# EAGLE design LCDShield (EAGLE 5.11)
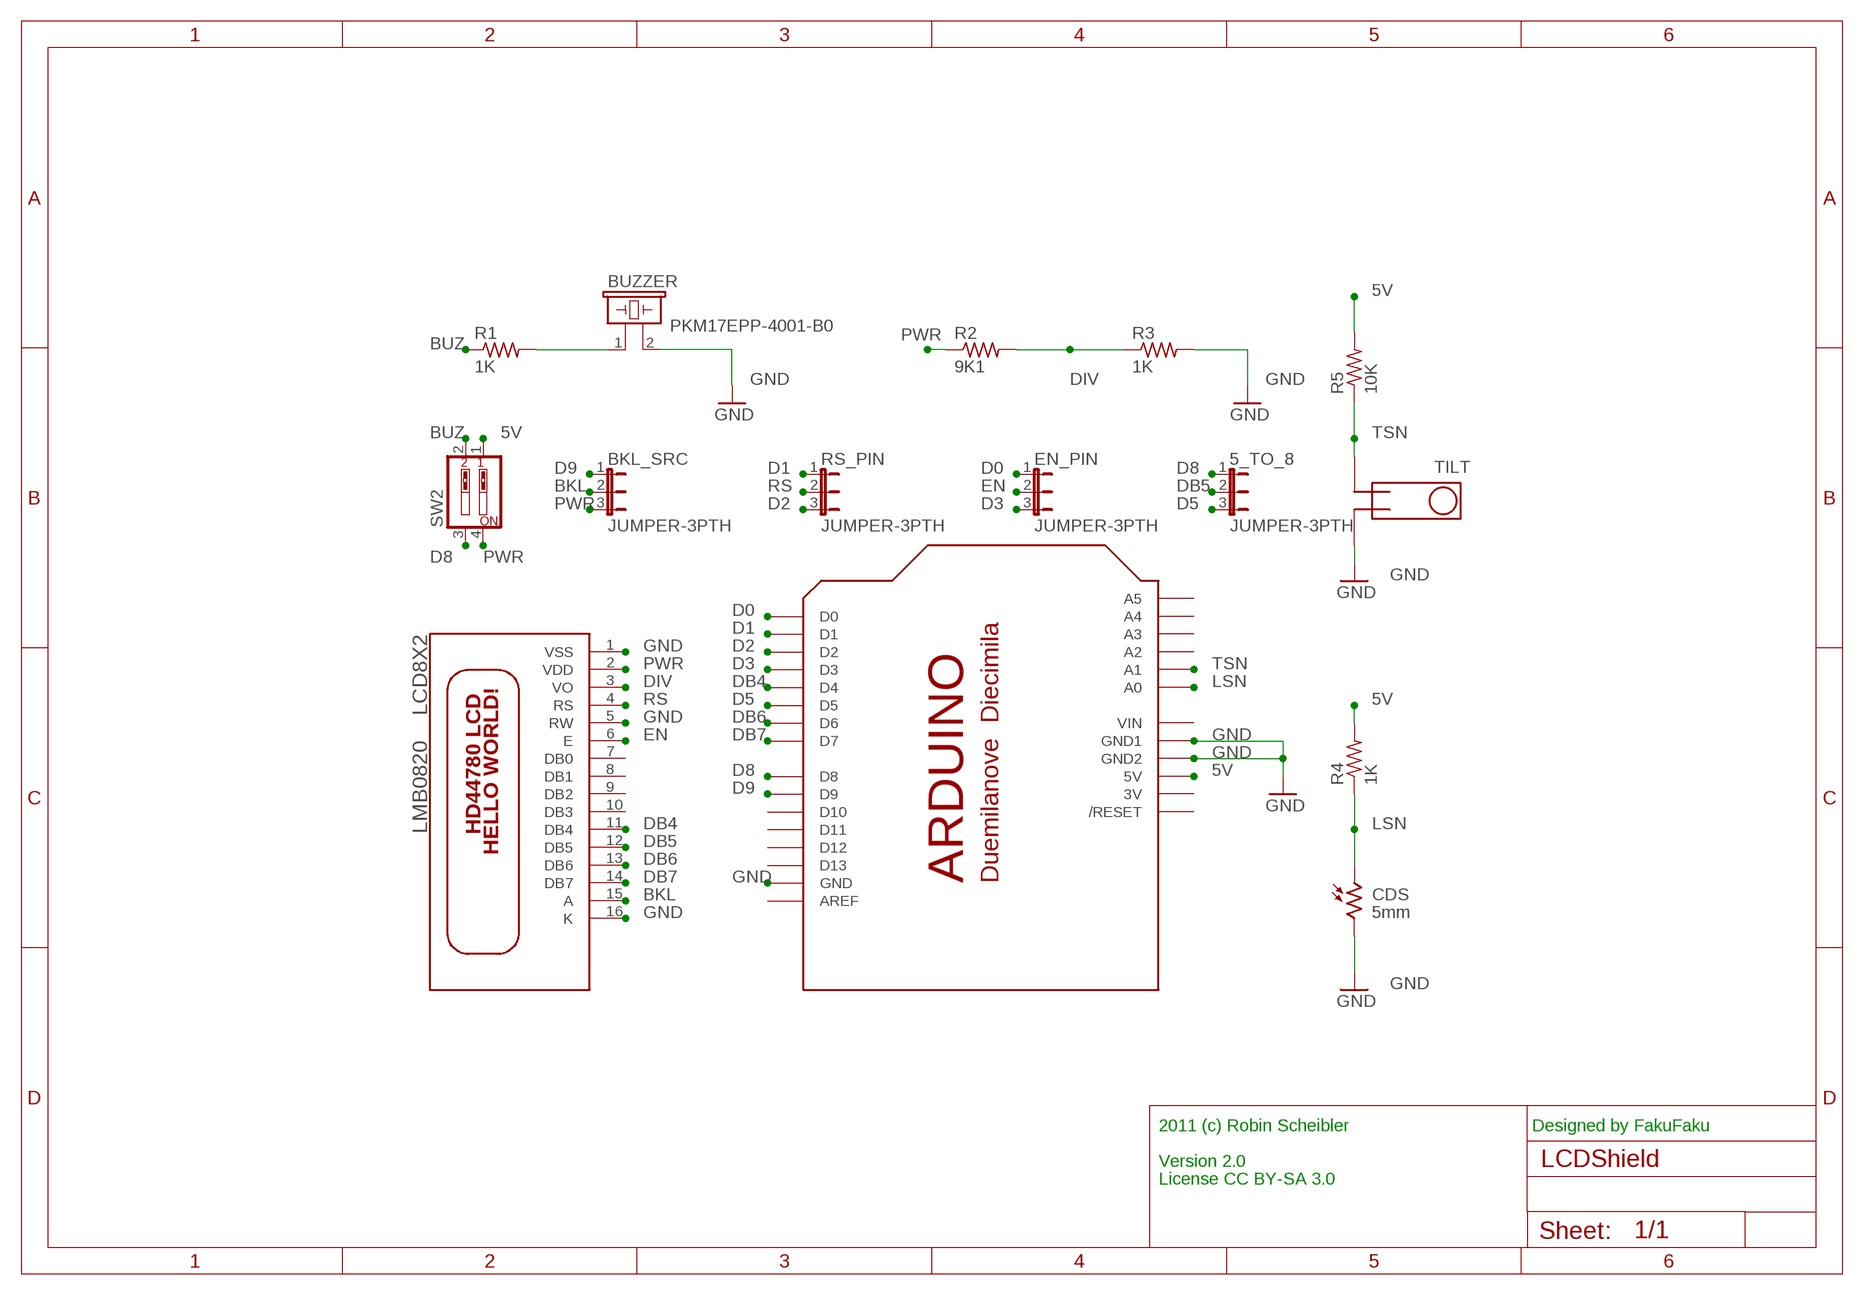
[diagram p0: schematic, sheet 1]

## Parts
5_TO_8  JUMPER-3PTH  [1X03]
BKL_SRC  JUMPER-3PTH  [1X03]
BUZZER  PKM17EPP-4001-B0  [PKM17EPP-4001-B0]
CDS  5mm  VT20N1  [TO46-VT200]
EN_PIN  JUMPER-3PTH  [1X03]
LCD8X2  LMB0820  [LMB0820]
R1  1K  R-US_0207/10  [0207/10]
R2  9K1  R-US_0207/10  [0207/10]
R3  1K  R-US_0207/10  [0207/10]
R4  1K  R-US_0207/10  [0207/10]
R5  10K  R-US_0207/10  [0207/10]
RS_PIN  JUMPER-3PTH  [1X03]
SHIELD  ARDUINOSHIELD-NOHOLE  [ARDUINO-NOHOLE]
SW2  SW_DIP-2  [EDG-02]
TILT  RBS040200  TILT_SWITCH  [RBS040200]

## Nets
5V: R4.2 R5.2 SHIELD.5V SW2.1
BKL: BKL_SRC.2 LCD8X2.15(A)
BUZ: R1.1 SW2.2
D0: EN_PIN.1 SHIELD.D0
D1: RS_PIN.1 SHIELD.D1
D2: RS_PIN.3 SHIELD.D2
D3: EN_PIN.3 SHIELD.D3
D5: 5_TO_8.3 SHIELD.D5
D8: 5_TO_8.1 SHIELD.D8 SW2.3
D9: BKL_SRC.1 SHIELD.D9
DB4: LCD8X2.11(DB4) SHIELD.D4
DB5: 5_TO_8.2 LCD8X2.12(DB5)
DB6: LCD8X2.13(DB6) SHIELD.D6
DB7: LCD8X2.14(DB7) SHIELD.D7
DIV: LCD8X2.3(VO) R2.2 R3.1
EN: EN_PIN.2 LCD8X2.6(E)
GND: BUZZER.2 CDS.2 LCD8X2.1(VSS) LCD8X2.5(RW) LCD8X2.16(K) R3.2 SHIELD.GND SHIELD.GND1 SHIELD.GND2 TILT.3
LSN: CDS.1 R4.1 SHIELD.A0
N$1: BUZZER.1 R1.2
PWR: BKL_SRC.3 LCD8X2.2(VDD) R2.1 SW2.4
RS: LCD8X2.4(RS) RS_PIN.2
TSN: R5.1 SHIELD.A1 TILT.4
Unconnected: LCD8X2.7(DB0) LCD8X2.8(DB1) LCD8X2.9(DB2) LCD8X2.10(DB3) SHIELD.A2 SHIELD.A3 SHIELD.A4 SHIELD.A5 SHIELD.AREF SHIELD.D10 SHIELD.D11 SHIELD.D12 SHIELD.D13 SHIELD.RESET(/RESET)

## Notes on the sheet
- 2011 (c) Robin Scheibler | Designed by FakuFaku
- Version 2.0
- License CC BY-SA 3.0

## Power pins joined to a net without a drawn wire
3V: SHIELD.3V
VIN: SHIELD.VIN

## Library data of the parts
5_TO_8 BKL_SRC EN_PIN RS_PIN = SparkFun:JUMPER-3
BUZZER = Robin:PKM17EPP-4001-B0: BUZZER Source: muRata; OC_FARNELL: unknown; OC_NEWARK: unknown
CDS = photo-elements:VT2*: Photoconductive Cell VT200 Series Source: http://optoelectronics.perkinelmer.com/content/Datasheets/DTS_vt200seriesdatasheet.pdf
LCD8X2 = Robin:LMB0820: LMB0820 : LCD Screen from Seeed Studio
R1-R5 = adafruit:R-US_: RESISTOR, American symbol
SHIELD = Robin:ARDUINOSHIELD: Arduino Diecimila/Duemilanove Make a shield with ease, this package has all the named pins as well as the two mounting drill holes and an outline of the USB and DC power connector. The outline is on the DIMENSION layer, so if your board house uses it they will cut the outline to match. http://www.ladyada.net/library/pcb/eaglelibrary.html
SW2 = special:SW_DIP-2: DIP SWITCH
TILT = Robin:TILT_SWITCH: PIN HEADER With larger annulars

## Board
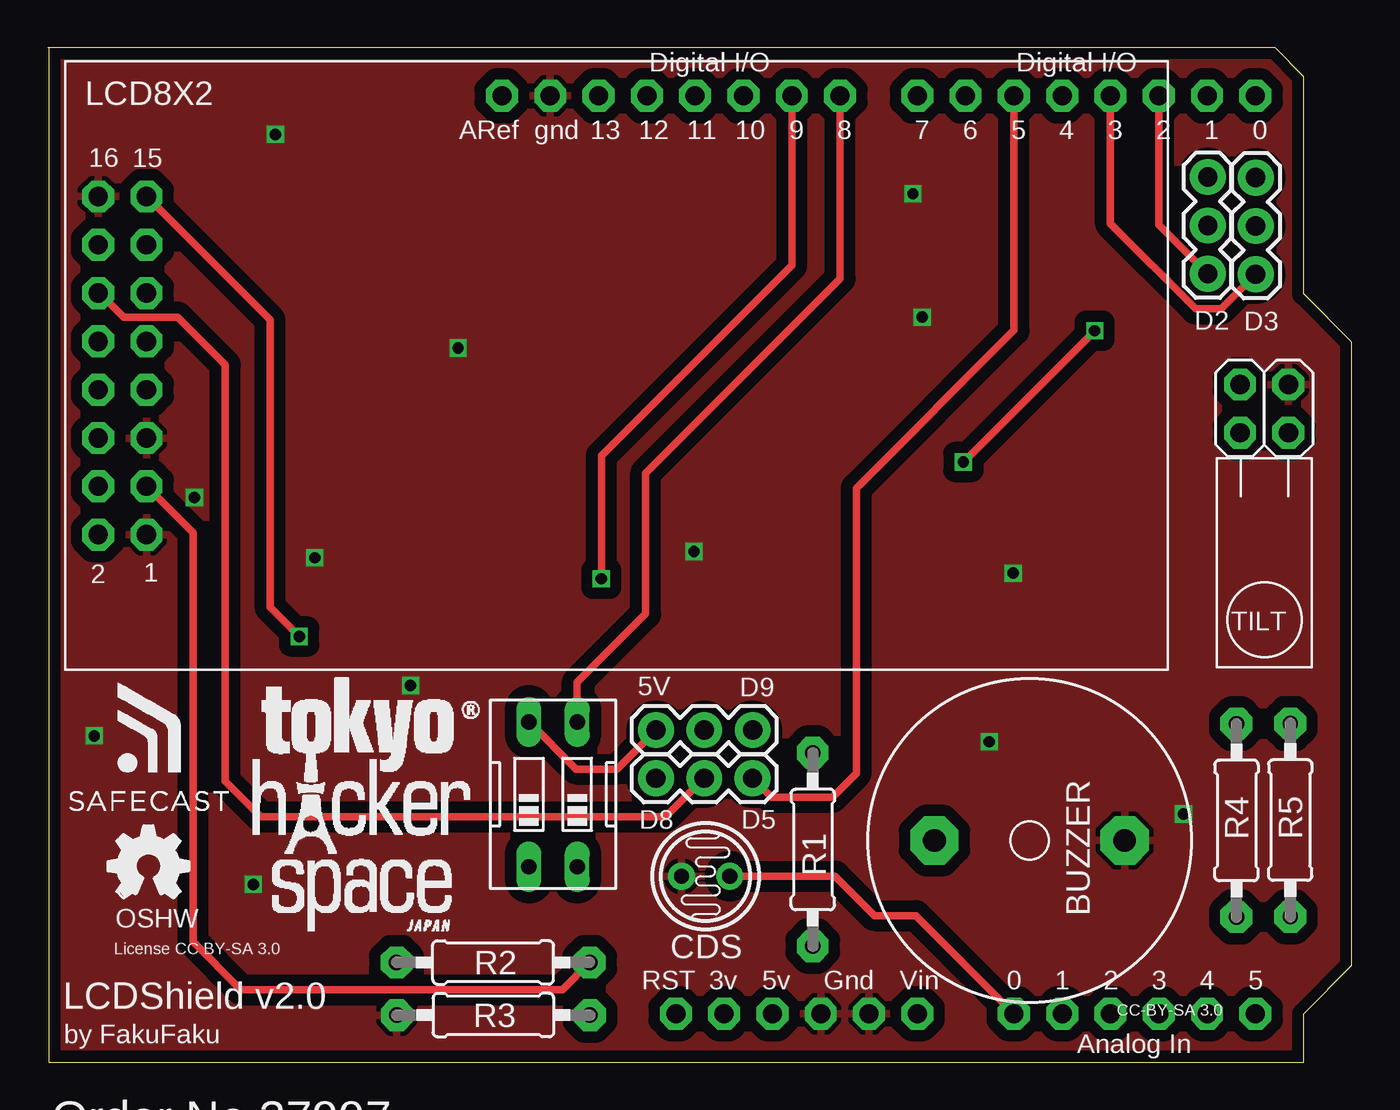
[diagram p1: board, top side]
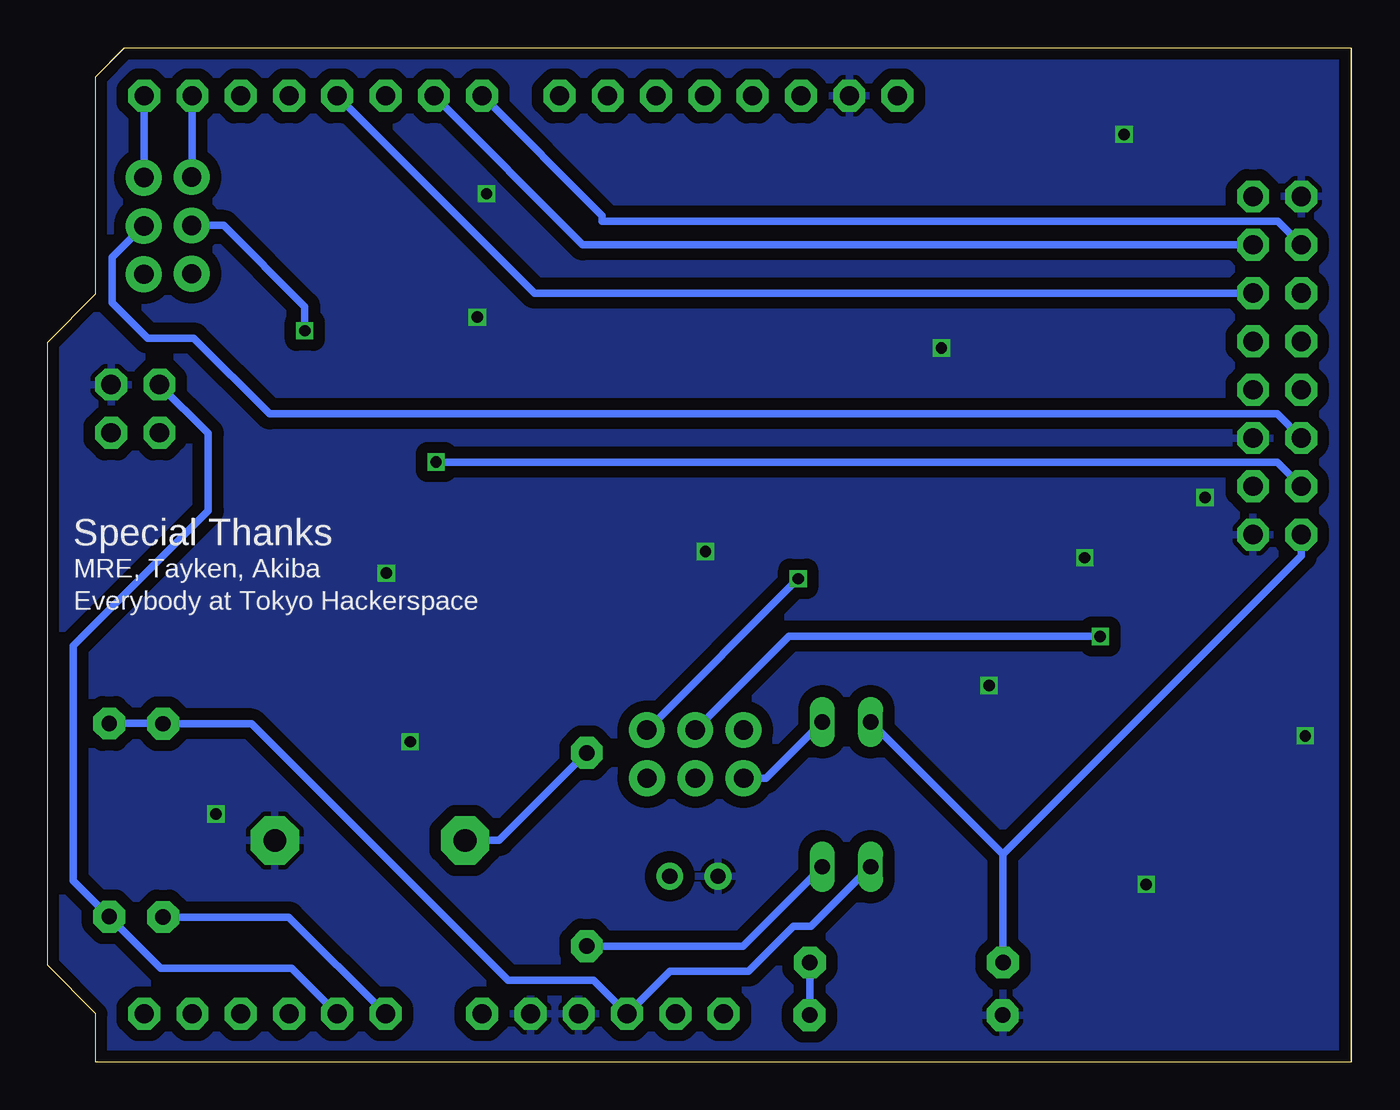
[diagram p2: board, bottom side, seen from below]

Size 68.61 x 53.34 mm. Coordinates in mm from the lower left corner, seen from the top.
Outline: 0,53.33 64.57,53.34 66.07,51.81 66.07,40.39 68.6,37.85 68.61,5.08 66.07,2.54 66.07,0 0.05,0 0.05,53.34
Copper layers (1*16): Top 0.035mm / dielectric 1.5mm / Bottom 0.035mm
Design rules "Fusion_eagle_rule_v1.1": minimum track width 6mil, minimum drill 12mil, track to track 6mil, track to pad 6mil, pad to pad 6mil, via to via 6mil, smd to smd 0mil, copper to edge 10mil, drill to drill 10mil, minimum pad ring 10mil, minimum via ring 6mil, stop-mask expansion 2mil, vias tented up to drill 100mil, thermal gap 10mil

### Footprints (pad centres in the part's own frame; a part is rotated, then mirrored left to right if it is on the bottom)
1X03 = drill 1.016 pad 1.88 round: 1 0,0; 2 2.54,0; 3 5.08,0
PKM17EPP-4001-B0@1 = drill 1.194 pad 2.54 octagon: 1 -5.004,0; 2 5.004,0
TO46-VT200 = drill 0.8 pad 1.4 round: 1 -1.27,0; 2 1.27,0
LMB0820 = drill 1.016 pad 1.676 octagon: 1 -24.73,-8.89; 2 -27.27,-8.89; 3 -24.73,-6.35; 4 -27.27,-6.35; 5 -24.73,-3.81; 6 -27.27,-3.81; 7 -24.73,-1.27; 8 -27.27,-1.27; 9 -24.73,1.27; 10 -27.27,1.27; 11 -24.73,3.81; 12 -27.27,3.81; 13 -24.73,6.35; 14 -27.27,6.35; 15 -24.73,8.89; 16 -27.27,8.89
0207/10 = drill 0.813 pad 1.676 octagon: 1 -5.08,0; 2 5.08,0
ARDUINO-NOHOLE = drill 1 pad 1.676 octagon: 3V 35.56,2.54; 5V 38.1,2.54; A0 50.8,2.54; A1 53.34,2.54; A2 55.88,2.54; A3 58.42,2.54; A4 60.96,2.54; A5 63.5,2.54; AREF 23.876,50.8; D0 63.5,50.8; D1 60.96,50.8; D2 58.42,50.8; D3 55.88,50.8; D4 53.34,50.8; D5 50.8,50.8; D6 48.26,50.8; D7 45.72,50.8; D8 41.656,50.8; D9 39.116,50.8; D10 36.576,50.8; D11 34.036,50.8; D12 31.496,50.8; D13 28.956,50.8; GND 26.416,50.8; GND1 43.18,2.54; GND2 40.64,2.54; RESET 33.02,2.54; VIN 45.72,2.54
EDG-02 = drill 0.813 long: 1 -1.27,-3.81; 2 1.27,-3.81; 3 1.27,3.81; 4 -1.27,3.81
RBS040200 = drill 1.016 pad 1.676 octagon: 1 -1.26,-1.33; 2 1.28,-1.33; 3 -1.26,-3.87; 4 1.28,-3.87

### Placement (x,y rotation side)
5_TO_8  32,14.92 0 top
BKL_SRC  37.09,17.45 180 top
BUZZER  PKM17EPP-4001-B0  [PKM17EPP-4001-B0@1]  51.65,11.65 0 top
CDS  34.61,9.77 180 top
EN_PIN  63.54,46.5 270 top
LCD8X2  29.93,36.62 0 top
R1  40.25,11.18 90 top
R2  23.43,5.24 0 top
R3  23.45,2.47 180 top
R4  62.53,12.71 90 top
R5  65.36,12.72 90 top
RS_PIN  61.02,46.53 270 top
SHIELD  0.03,0 0 top
SW2  26.59,14.08 0 top
TILT  64,31.75 180 top
U$1  [THS]  6.88,3.94 0 top
U$4  [OSHW_FILLX150_NOTEXT]  3.18,8.62 0 top

### Tracks (layer width: path | path; a pad name or v marks a point on that pad's centre or on a via)
5V
  Bottom 0.406: SW2.1 28.45,7.14 29.38,7.14 31.73,4.78 35.87,4.78 38.11,2.54 SHIELD.5V 39.88,4.3 44.38,4.3 57.87,17.79 R4.2 62.55,17.8 R5.2
BKL  (via drill 0.6)
  Top 0.406: v13.24,22.38 11.7,23.92 11.7,39.02 LCD8X2.15
  Bottom 0.406: BKL_SRC.2 29.62,22.38 v13.24,22.38
BUZ
  Bottom 0.406: R1.1 32.03,6.1 SW2.2
D0
  Bottom 0.406: EN_PIN.1 63.53,46.52 SHIELD.D0
D1
  Bottom 0.406: RS_PIN.1 60.99,46.57 SHIELD.D1
D2
  Top 0.406: RS_PIN.3 58.45,44.03 SHIELD.D2
D3
  Top 0.406: EN_PIN.3 61.72,39.6 60.39,39.6 55.91,44.09 SHIELD.D3
D5
  Top 0.406: 5_TO_8.3 38.07,13.92 41.28,13.92 42.54,15.19 42.54,30.18 50.83,38.47 SHIELD.D5
D8
  Top 0.406: SW2.3 27.86,19.97 31.45,23.56 31.45,30.97 41.68,41.2 SHIELD.D8
  Bottom 0.406: SW2.3 30.83,14.92 5_TO_8.1
D9  (via drill 0.6)
  Top 0.406: v29.12,25.41 29.12,31.87 39.14,41.88 SHIELD.D9
  Bottom 0.406: BKL_SRC.1 v29.12,25.41
DB4
  Bottom 0.406: LCD8X2.11 43,40.43 SHIELD.D4
DB5
  Top 0.406: 5_TO_8.2 32.51,12.89 11.22,12.89 9.35,14.76 9.35,36.65 6.84,39.17 4,39.17 2.73,40.43 LCD8X2.12
DB6
  Bottom 0.406: LCD8X2.13 40.46,42.97 SHIELD.D6
DB7
  Bottom 0.406: LCD8X2.14 3.89,44.2 39.43,44.2 39.43,44.49 SHIELD.D7
DIV
  Top 0.406: LCD8X2.3 7.65,27.83 7.65,6.33 10.16,3.81 27.09,3.81 R2.2
  Bottom 0.406: R2.2 28.51,2.48 R3.1
EN
  Bottom 0.406: LCD8X2.6 3.93,34.08 56.92,34.08 60.91,38.07 63.34,38.07 65.19,39.92 65.19,42.31 EN_PIN.2
GND  (via drill 0.6)
  other vias: 14.05,26.52 7.73,29.68 2.45,17.16 19.09,19.8 21.59,37.55 46,39.17 45.51,45.65 50.78,25.71 34,26.84 10.82,9.35 49.53,16.84 59.75,13.05 11.99,48.78
  pour Bottom (isolate 0.61): -4.8,-2.54 -4.8,57.66 69.88,57.66 69.88,-2.54
  pour Top (isolate 0.61): -2.77,56.13 -2.77,-25.4 70.38,-25.4 70.38,56.13 -2.51,56.13
LSN
  Top 0.406: CDS.1 41.42,9.77 43.49,7.7 45.66,7.7 SHIELD.A0
  Bottom 0.406: SHIELD.A0 55.91,7.63 R4.1
N$1
  Bottom 0.406: R1.2 44.85,11.65 BUZZER.1
PWR
  Top 0.406: BKL_SRC.3 29.96,15.41 27.8,15.41 SW2.4
  Bottom 0.406: R2.1 18.35,10.93 | 18.35,10.93 SW2.4 | LCD8X2.2 2.66,26.62 18.35,10.93
RS  (via drill 0.6)
  Top 0.406: v48.17,31.55 v55.08,38.45
  Bottom 0.406: LCD8X2.4 3.94,31.55 v48.17,31.55 | v55.08,38.45 55.08,39.72 59.34,43.99 RS_PIN.2
TSN
  Bottom 0.406: SHIELD.A1 55.77,4.95 62.67,4.95 R5.1 67.25,9.53 67.25,21.89 60.15,29 60.15,33.05 TILT.4

### Text on the board
tPlace: OSHW | License CC BY-SA 3.0
tNames: 16 | 15 | D2 | D3 | 2 | 1 | 5V | D9 | D8 | D5 | LCDShield v2.0 | CC-BY-SA 3.0 | by FakuFaku | Order No 37997
bNames: Special Thanks | MRE, Tayken, Akiba | Everybody at Tokyo Hackerspace